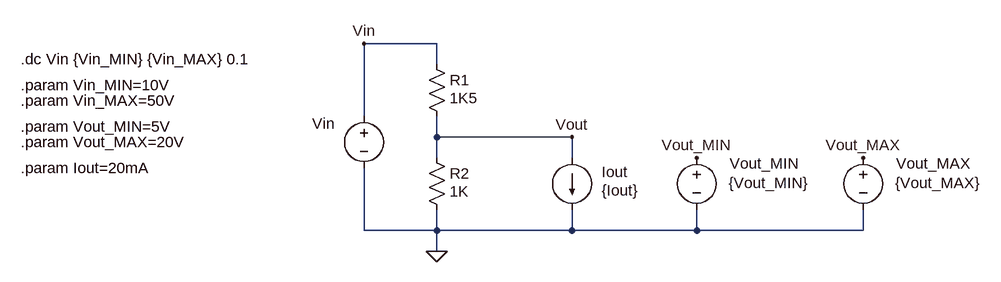
[diagram p0: schematic topology_A.asc]
topology_A.asc, the LTspice schematic file:
Version 4.1
SHEET 1 2220 680
WIRE 160 64 48 64
WIRE 160 96 160 64
WIRE 48 176 48 64
WIRE 160 208 160 176
WIRE 368 208 160 208
WIRE 160 240 160 208
WIRE 368 240 368 208
WIRE 48 352 48 256
WIRE 160 352 160 320
WIRE 160 352 48 352
WIRE 368 352 368 320
WIRE 368 352 160 352
WIRE 560 352 560 320
WIRE 560 352 368 352
WIRE 816 352 816 320
WIRE 816 352 560 352
WIRE 160 384 160 352
FLAG 48 64 Vin
FLAG 160 384 0
FLAG 368 208 Vout
FLAG 560 240 Vout_MIN
FLAG 816 240 Vout_MAX
SYMBOL res 144 80 R0
WINDOW 3 36 68 Left 2
SYMATTR InstName R1
SYMATTR Value 1K5
SYMBOL res 144 224 R0
WINDOW 3 36 68 Left 2
SYMATTR InstName R2
SYMATTR Value 1K
SYMBOL voltage 48 160 R0
WINDOW 123 0 0 Left 0
WINDOW 39 0 0 Left 0
WINDOW 0 -80 27 Left 2
WINDOW 3 -82 66 Left 2
SYMATTR InstName Vin
SYMATTR Value ""
SYMBOL current 368 240 R0
WINDOW 0 46 22 Left 2
WINDOW 3 46 50 Left 2
WINDOW 123 0 0 Left 0
WINDOW 39 0 0 Left 0
SYMATTR InstName Iout
SYMATTR Value {Iout}
SYMBOL voltage 560 224 R0
WINDOW 123 0 0 Left 0
WINDOW 39 0 0 Left 0
WINDOW 0 51 25 Left 2
WINDOW 3 49 55 Left 2
SYMATTR InstName Vout_MIN
SYMATTR Value {Vout_MIN}
SYMBOL voltage 816 224 R0
WINDOW 123 0 0 Left 0
WINDOW 39 0 0 Left 0
WINDOW 0 51 25 Left 2
WINDOW 3 49 55 Left 2
SYMATTR InstName Vout_MAX
SYMATTR Value {Vout_MAX}
TEXT -480 88 Left 2 !.dc Vin {Vin_MIN} {Vin_MAX} 0.1
TEXT -480 128 Left 2 !.param Vin_MIN=10V
TEXT -480 152 Left 2 !.param Vin_MAX=50V
TEXT -480 192 Left 2 !.param Vout_MIN=5V
TEXT -480 216 Left 2 !.param Vout_MAX=20V
TEXT -480 256 Left 2 !.param Iout=20mA

The netlist it stands for:
* topology_A.asc
R1 Vin Vout 1K5
R2 Vout 0 1K
Vin Vin 0
Iout Vout 0 {Iout}
Vout_MIN Vout_MIN 0 {Vout_MIN}
Vout_MAX Vout_MAX 0 {Vout_MAX}
.dc Vin {Vin_MIN} {Vin_MAX} 0.1
.param Vin_MIN=10V
.param Vin_MAX=50V
.param Vout_MIN=5V
.param Vout_MAX=20V
.param Iout=20mA
.backanno
.end